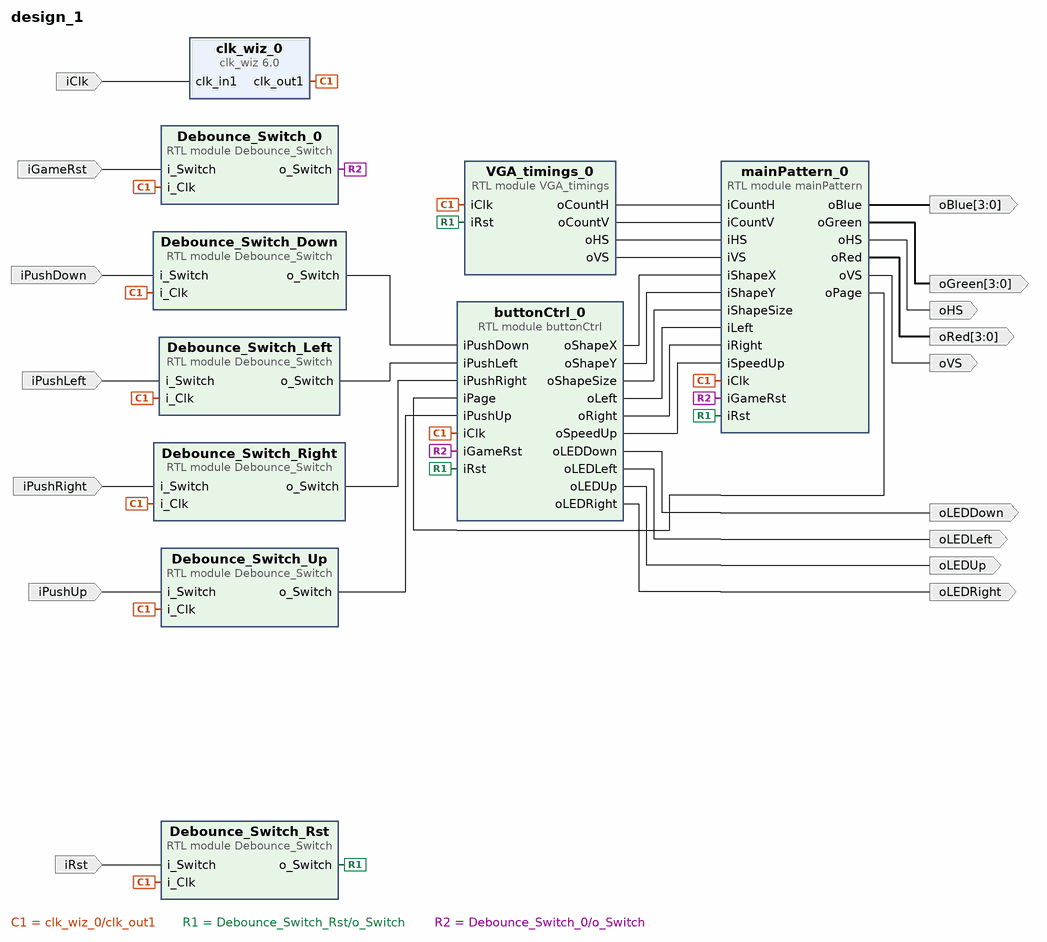
[diagram p0: block diagram of the top level]
# Vivado block design design_1, xc7z020clg400-1, Vivado 2020.1
create_bd_design design_1

create_bd_port -dir O -from 3 -to 0 oRed
create_bd_port -dir O -from 3 -to 0 oGreen
create_bd_port -dir O -from 3 -to 0 oBlue
create_bd_port -dir I iRst
create_bd_port -dir I iPushUp
create_bd_port -dir I iPushDown
create_bd_port -dir I iPushLeft
create_bd_port -dir I iPushRight
create_bd_port -dir I iGameRst
create_bd_port -dir O oLEDUp
create_bd_port -dir O oLEDDown
create_bd_port -dir O oLEDLeft
create_bd_port -dir O oLEDRight
create_bd_port -dir O oHS
create_bd_port -dir O oVS
create_bd_port -dir I -type clk iClk

create_bd_cell -type module -reference Debounce_Switch Debounce_Switch_Up
create_bd_cell -type module -reference Debounce_Switch Debounce_Switch_Down
create_bd_cell -type module -reference Debounce_Switch Debounce_Switch_Left
create_bd_cell -type module -reference Debounce_Switch Debounce_Switch_Right
create_bd_cell -type module -reference Debounce_Switch Debounce_Switch_Rst
create_bd_cell -type module -reference Debounce_Switch Debounce_Switch_0
create_bd_cell -type module -reference VGA_timings VGA_timings_0
create_bd_cell -type ip -vlnv xilinx.com:ip:clk_wiz:6.0 clk_wiz_0
set_property -dict [list \
  CONFIG.CLKIN1_JITTER_PS 80.0 \
  CONFIG.CLKOUT1_JITTER 312.659 \
  CONFIG.CLKOUT1_PHASE_ERROR 245.713 \
  CONFIG.CLKOUT1_REQUESTED_OUT_FREQ 25.000 \
  CONFIG.CLK_IN1_BOARD_INTERFACE sys_clock \
  CONFIG.MMCM_CLKFBOUT_MULT_F 36.500 \
  CONFIG.MMCM_CLKIN1_PERIOD 8.000 \
  CONFIG.MMCM_CLKOUT0_DIVIDE_F 36.500 \
  CONFIG.MMCM_DIVCLK_DIVIDE 5 \
  CONFIG.USE_LOCKED false \
  CONFIG.USE_RESET false \
] [get_bd_cells clk_wiz_0]
create_bd_cell -type module -reference buttonCtrl buttonCtrl_0
create_bd_cell -type module -reference mainPattern mainPattern_0

# ---- connections ----

connect_bd_net [get_bd_pins buttonCtrl_0/oShapeX] [get_bd_pins mainPattern_0/iShapeX]
connect_bd_net [get_bd_pins buttonCtrl_0/oShapeY] [get_bd_pins mainPattern_0/iShapeY]
connect_bd_net [get_bd_pins buttonCtrl_0/oShapeSize] [get_bd_pins mainPattern_0/iShapeSize]
connect_bd_net [get_bd_pins mainPattern_0/oRed] [get_bd_ports oRed]
connect_bd_net [get_bd_pins mainPattern_0/oGreen] [get_bd_ports oGreen]
connect_bd_net [get_bd_pins mainPattern_0/oBlue] [get_bd_ports oBlue]
connect_bd_net [get_bd_pins VGA_timings_0/oCountH] [get_bd_pins mainPattern_0/iCountH]
connect_bd_net [get_bd_pins VGA_timings_0/oCountV] [get_bd_pins mainPattern_0/iCountV]
connect_bd_net [get_bd_pins clk_wiz_0/clk_out1] \
  [get_bd_pins Debounce_Switch_Rst/i_Clk] [get_bd_pins Debounce_Switch_Up/i_Clk] [get_bd_pins Debounce_Switch_Down/i_Clk] \
  [get_bd_pins Debounce_Switch_Left/i_Clk] [get_bd_pins Debounce_Switch_Right/i_Clk] [get_bd_pins Debounce_Switch_0/i_Clk] \
  [get_bd_pins VGA_timings_0/iClk] [get_bd_pins buttonCtrl_0/iClk] [get_bd_pins mainPattern_0/iClk]
connect_bd_net -net i_Switch_0_1 [get_bd_ports iRst] [get_bd_pins Debounce_Switch_Rst/i_Switch]
connect_bd_net -net i_Switch_0_2 [get_bd_ports iPushUp] [get_bd_pins Debounce_Switch_Up/i_Switch]
connect_bd_net -net i_Switch_0_3 [get_bd_ports iPushDown] [get_bd_pins Debounce_Switch_Down/i_Switch]
connect_bd_net -net i_Switch_0_4 [get_bd_ports iPushLeft] [get_bd_pins Debounce_Switch_Left/i_Switch]
connect_bd_net -net i_Switch_0_5 [get_bd_ports iPushRight] [get_bd_pins Debounce_Switch_Right/i_Switch]
connect_bd_net -net Debounce_Switch_4_o_Switch [get_bd_pins Debounce_Switch_Rst/o_Switch] \
  [get_bd_pins VGA_timings_0/iRst] [get_bd_pins buttonCtrl_0/iRst] [get_bd_pins mainPattern_0/iRst]
connect_bd_net [get_bd_pins Debounce_Switch_Up/o_Switch] [get_bd_pins buttonCtrl_0/iPushUp]
connect_bd_net [get_bd_pins Debounce_Switch_Down/o_Switch] [get_bd_pins buttonCtrl_0/iPushDown]
connect_bd_net [get_bd_pins Debounce_Switch_Left/o_Switch] [get_bd_pins buttonCtrl_0/iPushLeft]
connect_bd_net [get_bd_pins Debounce_Switch_Right/o_Switch] [get_bd_pins buttonCtrl_0/iPushRight]
connect_bd_net -net i_Switch_0_6 [get_bd_ports iGameRst] [get_bd_pins Debounce_Switch_0/i_Switch]
connect_bd_net [get_bd_pins Debounce_Switch_0/o_Switch] [get_bd_pins buttonCtrl_0/iGameRst] [get_bd_pins mainPattern_0/iGameRst]
connect_bd_net [get_bd_pins buttonCtrl_0/oLEDUp] [get_bd_ports oLEDUp]
connect_bd_net [get_bd_pins buttonCtrl_0/oLEDDown] [get_bd_ports oLEDDown]
connect_bd_net [get_bd_pins buttonCtrl_0/oLEDLeft] [get_bd_ports oLEDLeft]
connect_bd_net [get_bd_pins buttonCtrl_0/oLEDRight] [get_bd_ports oLEDRight]
connect_bd_net [get_bd_pins VGA_timings_0/oHS] [get_bd_pins mainPattern_0/iHS]
connect_bd_net [get_bd_pins VGA_timings_0/oVS] [get_bd_pins mainPattern_0/iVS]
connect_bd_net [get_bd_pins mainPattern_0/oHS] [get_bd_ports oHS]
connect_bd_net [get_bd_pins mainPattern_0/oVS] [get_bd_ports oVS]
connect_bd_net [get_bd_pins mainPattern_0/oPage] [get_bd_pins buttonCtrl_0/iPage]
connect_bd_net -net clk_in1_0_1 [get_bd_ports iClk] [get_bd_pins clk_wiz_0/clk_in1]
connect_bd_net [get_bd_pins buttonCtrl_0/oLeft] [get_bd_pins mainPattern_0/iLeft]
connect_bd_net [get_bd_pins buttonCtrl_0/oRight] [get_bd_pins mainPattern_0/iRight]
connect_bd_net [get_bd_pins buttonCtrl_0/oSpeedUp] [get_bd_pins mainPattern_0/iSpeedUp]

validate_bd_design
save_bd_design
